# EAGLE design pwm-fan-controller (EAGLE 9.6.2)
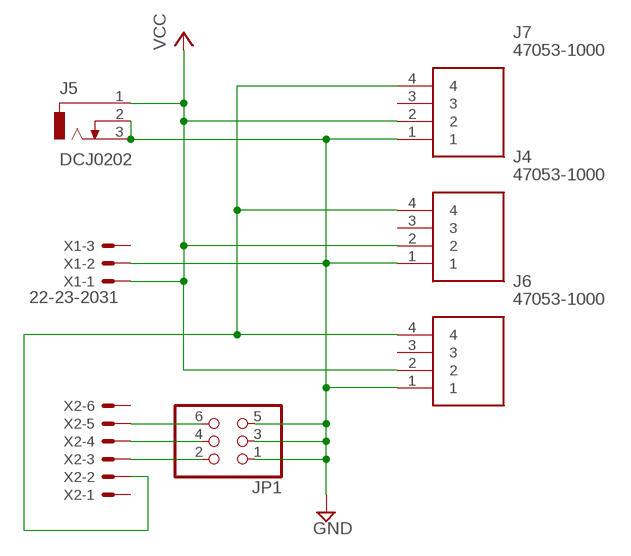
[diagram p0: schematic, sheet 1]

## Parts
J4  47053-1000  [470531000]
J5  DCJ0202  [DCJ0202]
J6  47053-1000  [470531000]
J7  47053-1000  [470531000]
JP1  PINHD-2X3  [2X03]
X1  22-23-2031  [22-23-2031]
X2  22-23-2061  [22-23-2061]

## Nets
GND: J4.1 J5.2 J5.3 J6.1 J7.1 JP1.1 JP1.3 JP1.5 X1.2
N$1: J4.4 J6.4 J7.4 X2.2
N$2: JP1.6 X2.5
N$3: JP1.4 X2.4
N$4: JP1.2 X2.3
VCC: J4.2 J5.1 J6.2 J7.2 X1.1
Unconnected: J4.3 J6.3 J7.3 X1.3 X2.1 X2.6

## Library data of the parts
J4 J6 J7 = 47053-1000:47053-1000: MOLEX - 47053-1000 - HEADER, 4POS, 1ROW, 2.54MM Source: Datasheet <http://www.molex.com/pdm_docs/sd/470531000_sd.pdf> Check availability <https://pricing.snapeda.com/parts/47053-1000/Molex/view-part?ref=eda>; AVAILABILITY: In Stock; CHECK_PRICES: https://www.snapeda.com/parts/47053-1000/Molex/view-part/?ref=eda; DESCRIPTION: Conn.; Rect./PCB; Header; 4 Cir.; Vert.; with Friction Lock; KK 254 Series | Molex Incorporated 47053-1000; MF: Molex; MP: 47053-1000; PACKAGE: None; PRICE: None; SNAPEDA_LINK: https://www.snapeda.com/parts/47053-1000/Molex/view-part/?ref=snap
J5 = con-jack:DCJ0202: DC POWER JACK Source: DCJ0202.pdf; OC_FARNELL: unknown; OC_NEWARK: unknown
JP1 = pinhead:PINHD-2X3: PIN HEADER
X1 = con-molex:22-23-2031: .100" (2.54mm) Center Header - 3 Pin; MF: MOLEX; MPN: 22-23-2031; OC_FARNELL: 1462950; OC_NEWARK: 30C0862
X2 = con-molex:22-23-2061: .100" (2.54mm) Center Header - 6 Pin; MF: MOLEX; MPN: 22-23-2061; OC_FARNELL: 1462922; OC_NEWARK: 27C1933

## Board
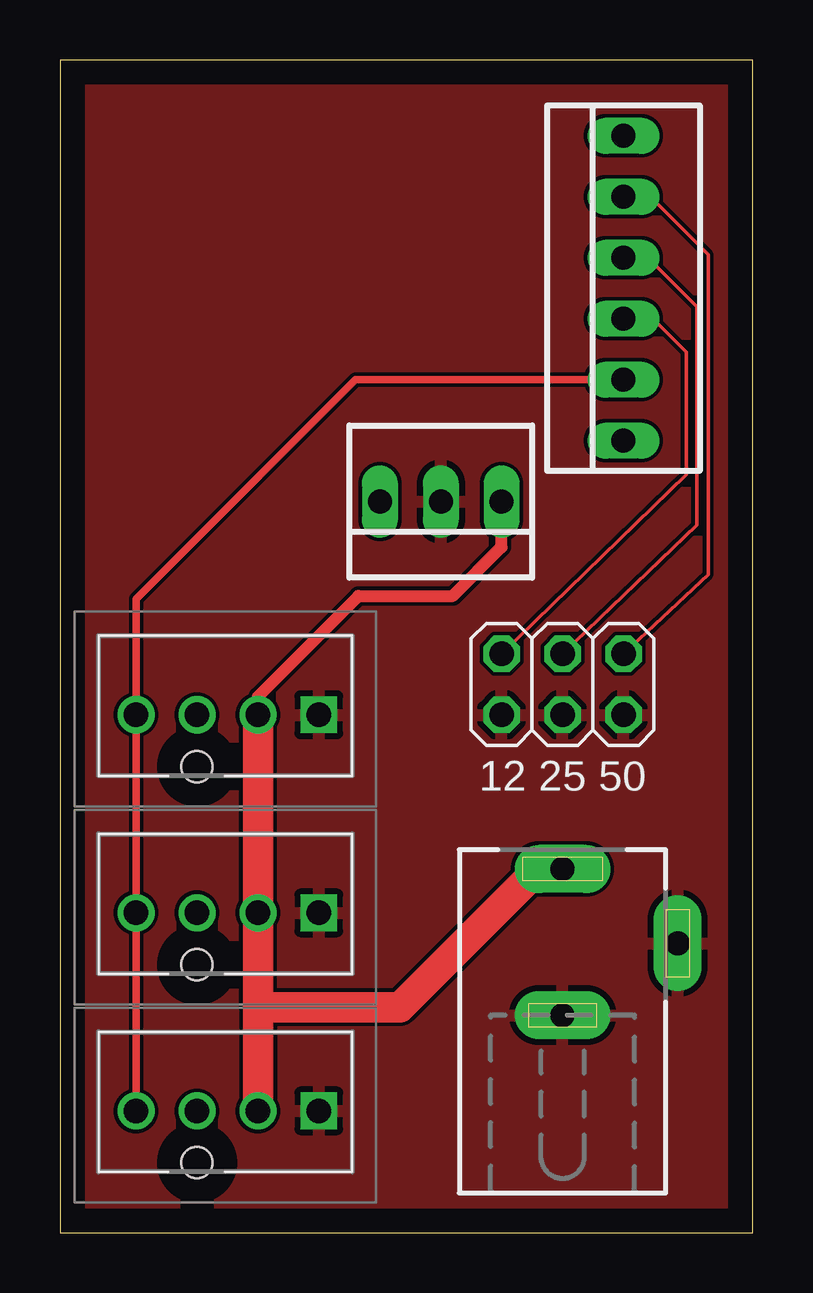
[diagram p1: board, top side]
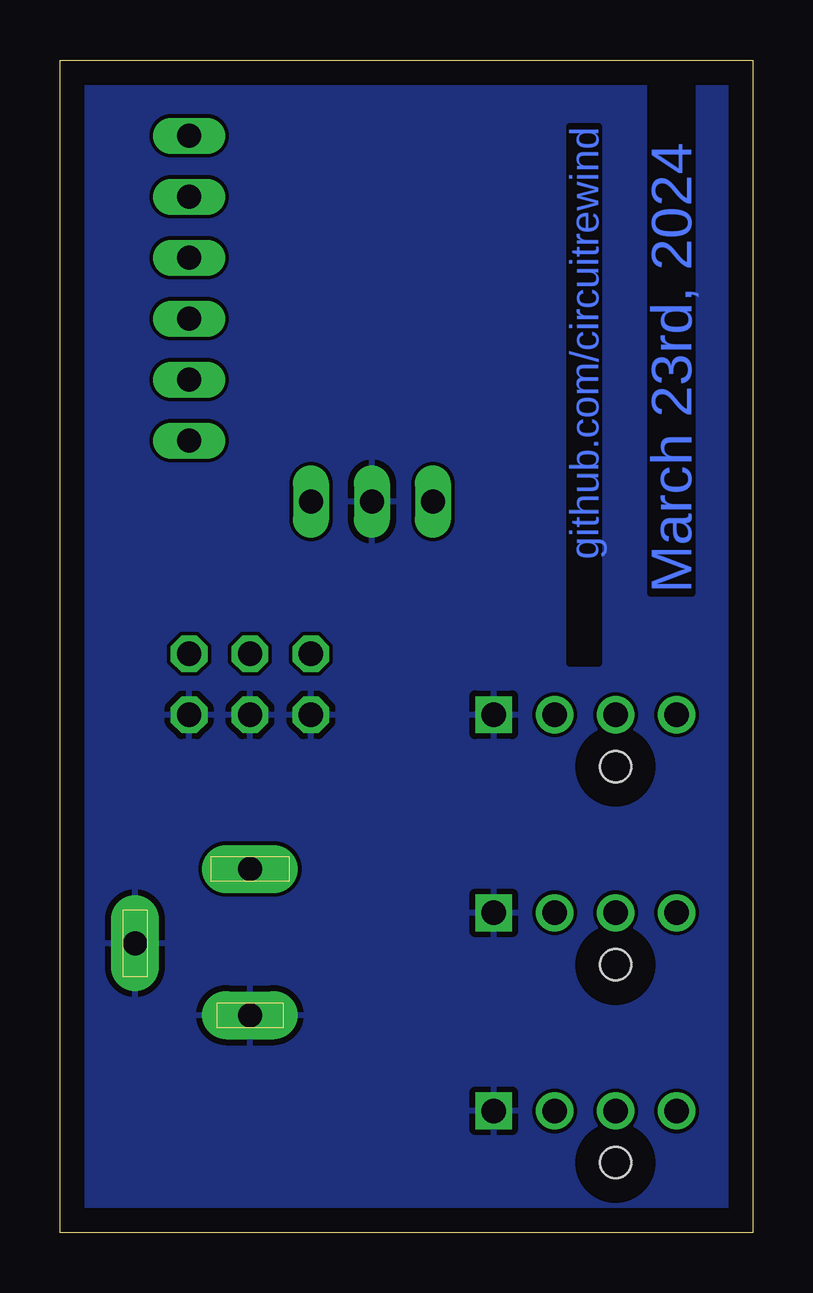
[diagram p2: board, bottom side, seen from below]

Size 28.88 x 48.88 mm. Coordinates in mm from the lower left corner, seen from the top.
Outline: 0,0 28.88,0 28.88,48.88 0,48.88 0,0
Copper layers (1*16): Top 0.035mm / dielectric 1.5mm / Bottom 0.035mm
Design rules "default": minimum track width 6mil, minimum drill 0.35mm, track to track 6mil, track to pad 6mil, pad to pad 6mil, via to via 6mil, smd to smd 6mil, copper to edge 40mil, drill to drill 6mil, minimum pad ring 10mil, minimum via ring 8mil, stop-mask expansion 4mil, vias tented up to drill 0mil, thermal gap 10mil

### Footprints (pad centres in the part's own frame; a part is rotated, then mirrored left to right if it is on the bottom)
470531000 = drill 1.02 pad 1.53 square: 1 0,0 | drill 1.02 pad 1.55: 2 -2.54,0; 3 -5.08,0; 4 -7.62,0 | hole 1.3: -5.08,-2.16
DCJ0202 = drill 1 pad 2 long: 1 0,3.1; 2 4.8,0; 3 0,-3
2X03 = drill 1.016 octagon: 1 -2.54,-1.27; 2 -2.54,1.27; 3 0,-1.27; 4 0,1.27; 5 2.54,-1.27; 6 2.54,1.27
22-23-2031 = drill 1 long: 1 -2.54,0; 2 0,0; 3 2.54,0
22-23-2061 = drill 1 long: 1 -6.35,0; 2 -3.81,0; 3 -1.27,0; 4 1.27,0; 5 3.81,0; 6 6.35,0

### Placement (x,y rotation side)
J4  10.79,21.59 0 top
J5  20.95,12.06 0 top
J6  10.79,13.34 0 top
J7  10.79,5.08 0 top
JP1  20.95,22.86 0 top
X1  15.88,30.48 180 top
X2  23.5,39.37 90 top

### Tracks (layer width: path | path; a pad name or v marks a point on that pad's centre or on a via)
GND
  pour Top: -5.08,53.98 -5.08,-3.17 34.92,-3.17 34.92,55.88 -5.08,55.88
  pour Bottom: -11.43,52.07 -11.43,-6.35 40.64,-6.35 40.64,52.07
N$1
  Top 0.305: J7.4 J6.4 J4.4 3.17,26.42 12.32,35.56 X2.2
N$2
  Top 0.152: X2.5 24.61,43.18 27.03,40.77 27.03,27.45 JP1.6
N$3
  Top 0.152: X2.4 24.51,40.64 26.54,38.61 26.54,29.49 JP1.4
N$4
  Top 0.152: X2.3 24.71,38.1 26.11,36.7 26.11,31.6 JP1.2
VCC
  Top 0.508: J4.2 8.26,22.35 12.45,26.54 16.38,26.54 18.41,28.57 X1.1
  Top 1.27: J5.1 19.94,15.16 14.17,9.4 8.26,9.4 | 8.26,9.4 J6.2 J4.2 | 8.26,9.4 J7.2

### Text on the board
Bottom: github.com/circuitrewind | March 23rd, 2024
tNames: 12 25 50